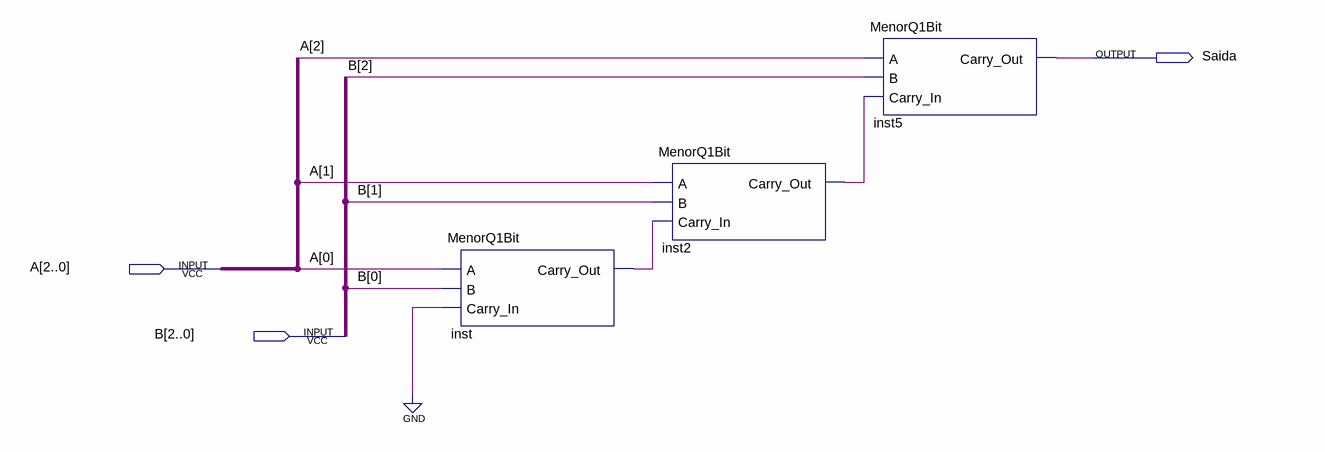
[diagram p0: schematic sheet]
// Quartus schematic MenorQ3Bit.bdf as structural Verilog: 3 symbols, 3 pins
module MenorQ3Bit (
  input  [2:0] A,
  input  [2:0] B,
  output Saida
);

  wire inst2_carry_out, inst_carry_out;

  MenorQ1Bit inst (.A(A[0]), .B(B[0]), .Carry_In(1'b0), .Carry_Out(inst_carry_out));
  MenorQ1Bit inst2 (.A(A[1]), .B(B[1]), .Carry_In(inst_carry_out), .Carry_Out(inst2_carry_out));
  MenorQ1Bit inst5 (.A(A[2]), .B(B[2]), .Carry_In(inst2_carry_out), .Carry_Out(Saida));
endmodule
